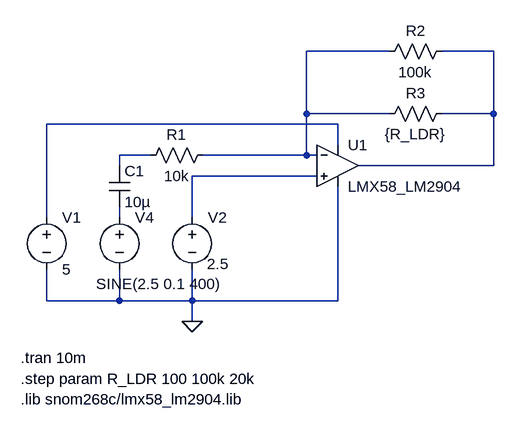
[diagram p0: schematic variable_gain_amplifier.asc]
variable_gain_amplifier.asc, the LTspice schematic file:
Version 4.1
SHEET 1 1184 680
WIRE 240 32 112 32
WIRE 400 32 320 32
WIRE 112 128 112 32
WIRE 240 128 112 128
WIRE 400 128 400 32
WIRE 400 128 320 128
WIRE 160 144 -288 144
WIRE 160 176 160 144
WIRE -128 192 -176 192
WIRE 112 192 112 128
WIRE 112 192 -48 192
WIRE 128 192 112 192
WIRE -176 208 -176 192
WIRE 400 208 400 128
WIRE 400 208 192 208
WIRE 128 224 -64 224
WIRE -288 288 -288 144
WIRE -176 288 -176 272
WIRE -64 288 -64 224
WIRE -288 416 -288 368
WIRE -176 416 -176 368
WIRE -176 416 -288 416
WIRE -64 416 -64 368
WIRE -64 416 -176 416
WIRE 160 416 160 240
WIRE 160 416 -64 416
WIRE -64 448 -64 416
FLAG -64 448 0
SYMBOL voltage -288 272 R0
WINDOW 123 0 0 Left 0
WINDOW 39 0 0 Left 0
SYMATTR InstName V1
SYMATTR Value 5
SYMBOL voltage -64 272 R0
WINDOW 3 23 87 Left 2
WINDOW 123 0 0 Left 0
WINDOW 39 0 0 Left 0
SYMATTR Value 2.5
SYMATTR InstName V2
SYMBOL voltage -176 272 R0
WINDOW 3 -36 118 Left 2
WINDOW 123 0 0 Left 0
WINDOW 39 0 0 Left 0
SYMATTR Value SINE(2.5 0.1 400)
SYMATTR InstName V4
SYMBOL res -32 176 R90
WINDOW 0 0 56 VBottom 2
WINDOW 3 32 56 VTop 2
SYMATTR InstName R1
SYMATTR Value 10k
SYMBOL res 336 16 R90
WINDOW 0 0 56 VBottom 2
WINDOW 3 32 56 VTop 2
SYMATTR InstName R2
SYMATTR Value 100k
SYMBOL res 336 112 R90
WINDOW 0 0 56 VBottom 2
WINDOW 3 32 56 VTop 2
SYMATTR InstName R3
SYMATTR Value {R_LDR}
SYMBOL cap -192 208 R0
SYMATTR InstName C1
SYMATTR Value 10µ
SYMBOL OpAmps\\opamp2 160 144 R0
SYMATTR InstName U1
SYMATTR Value LMX58_LM2904
TEXT -328 504 Left 2 !.tran 10m
TEXT -328 536 Left 2 !.step param R_LDR 100 100k 20k
TEXT -328 568 Left 2 !.lib snom268c/lmx58_lm2904.lib

The netlist it stands for:
* variable_gain_amplifier.asc
V1 N003 0 5
V2 N005 0 2.5
V4 N006 0 SINE(2.5 0.1 400)
R1 N001 N004 10k
R2 N002 N001 100k
R3 N002 N001 {R_LDR}
C1 N004 N006 10µ
X§U1 N005 N001 N003 0 N002 LMX58_LM2904  ; pins In+ In- V+ V- OUT
.tran 10m
.step param R_LDR 100 100k 20k
.lib snom268c/lmx58_lm2904.lib
.backanno
.end